# EasyEDA Pro project ESP32C3_Motor_MainControl.eprj, schematic LED_WS2812B
Page Name: P1; Project Name: ESP32C3PowerKey; Schematic Name: LED_WS2812B; Company: 嘉立创EDA; Page Size: A4; Version: V1.0
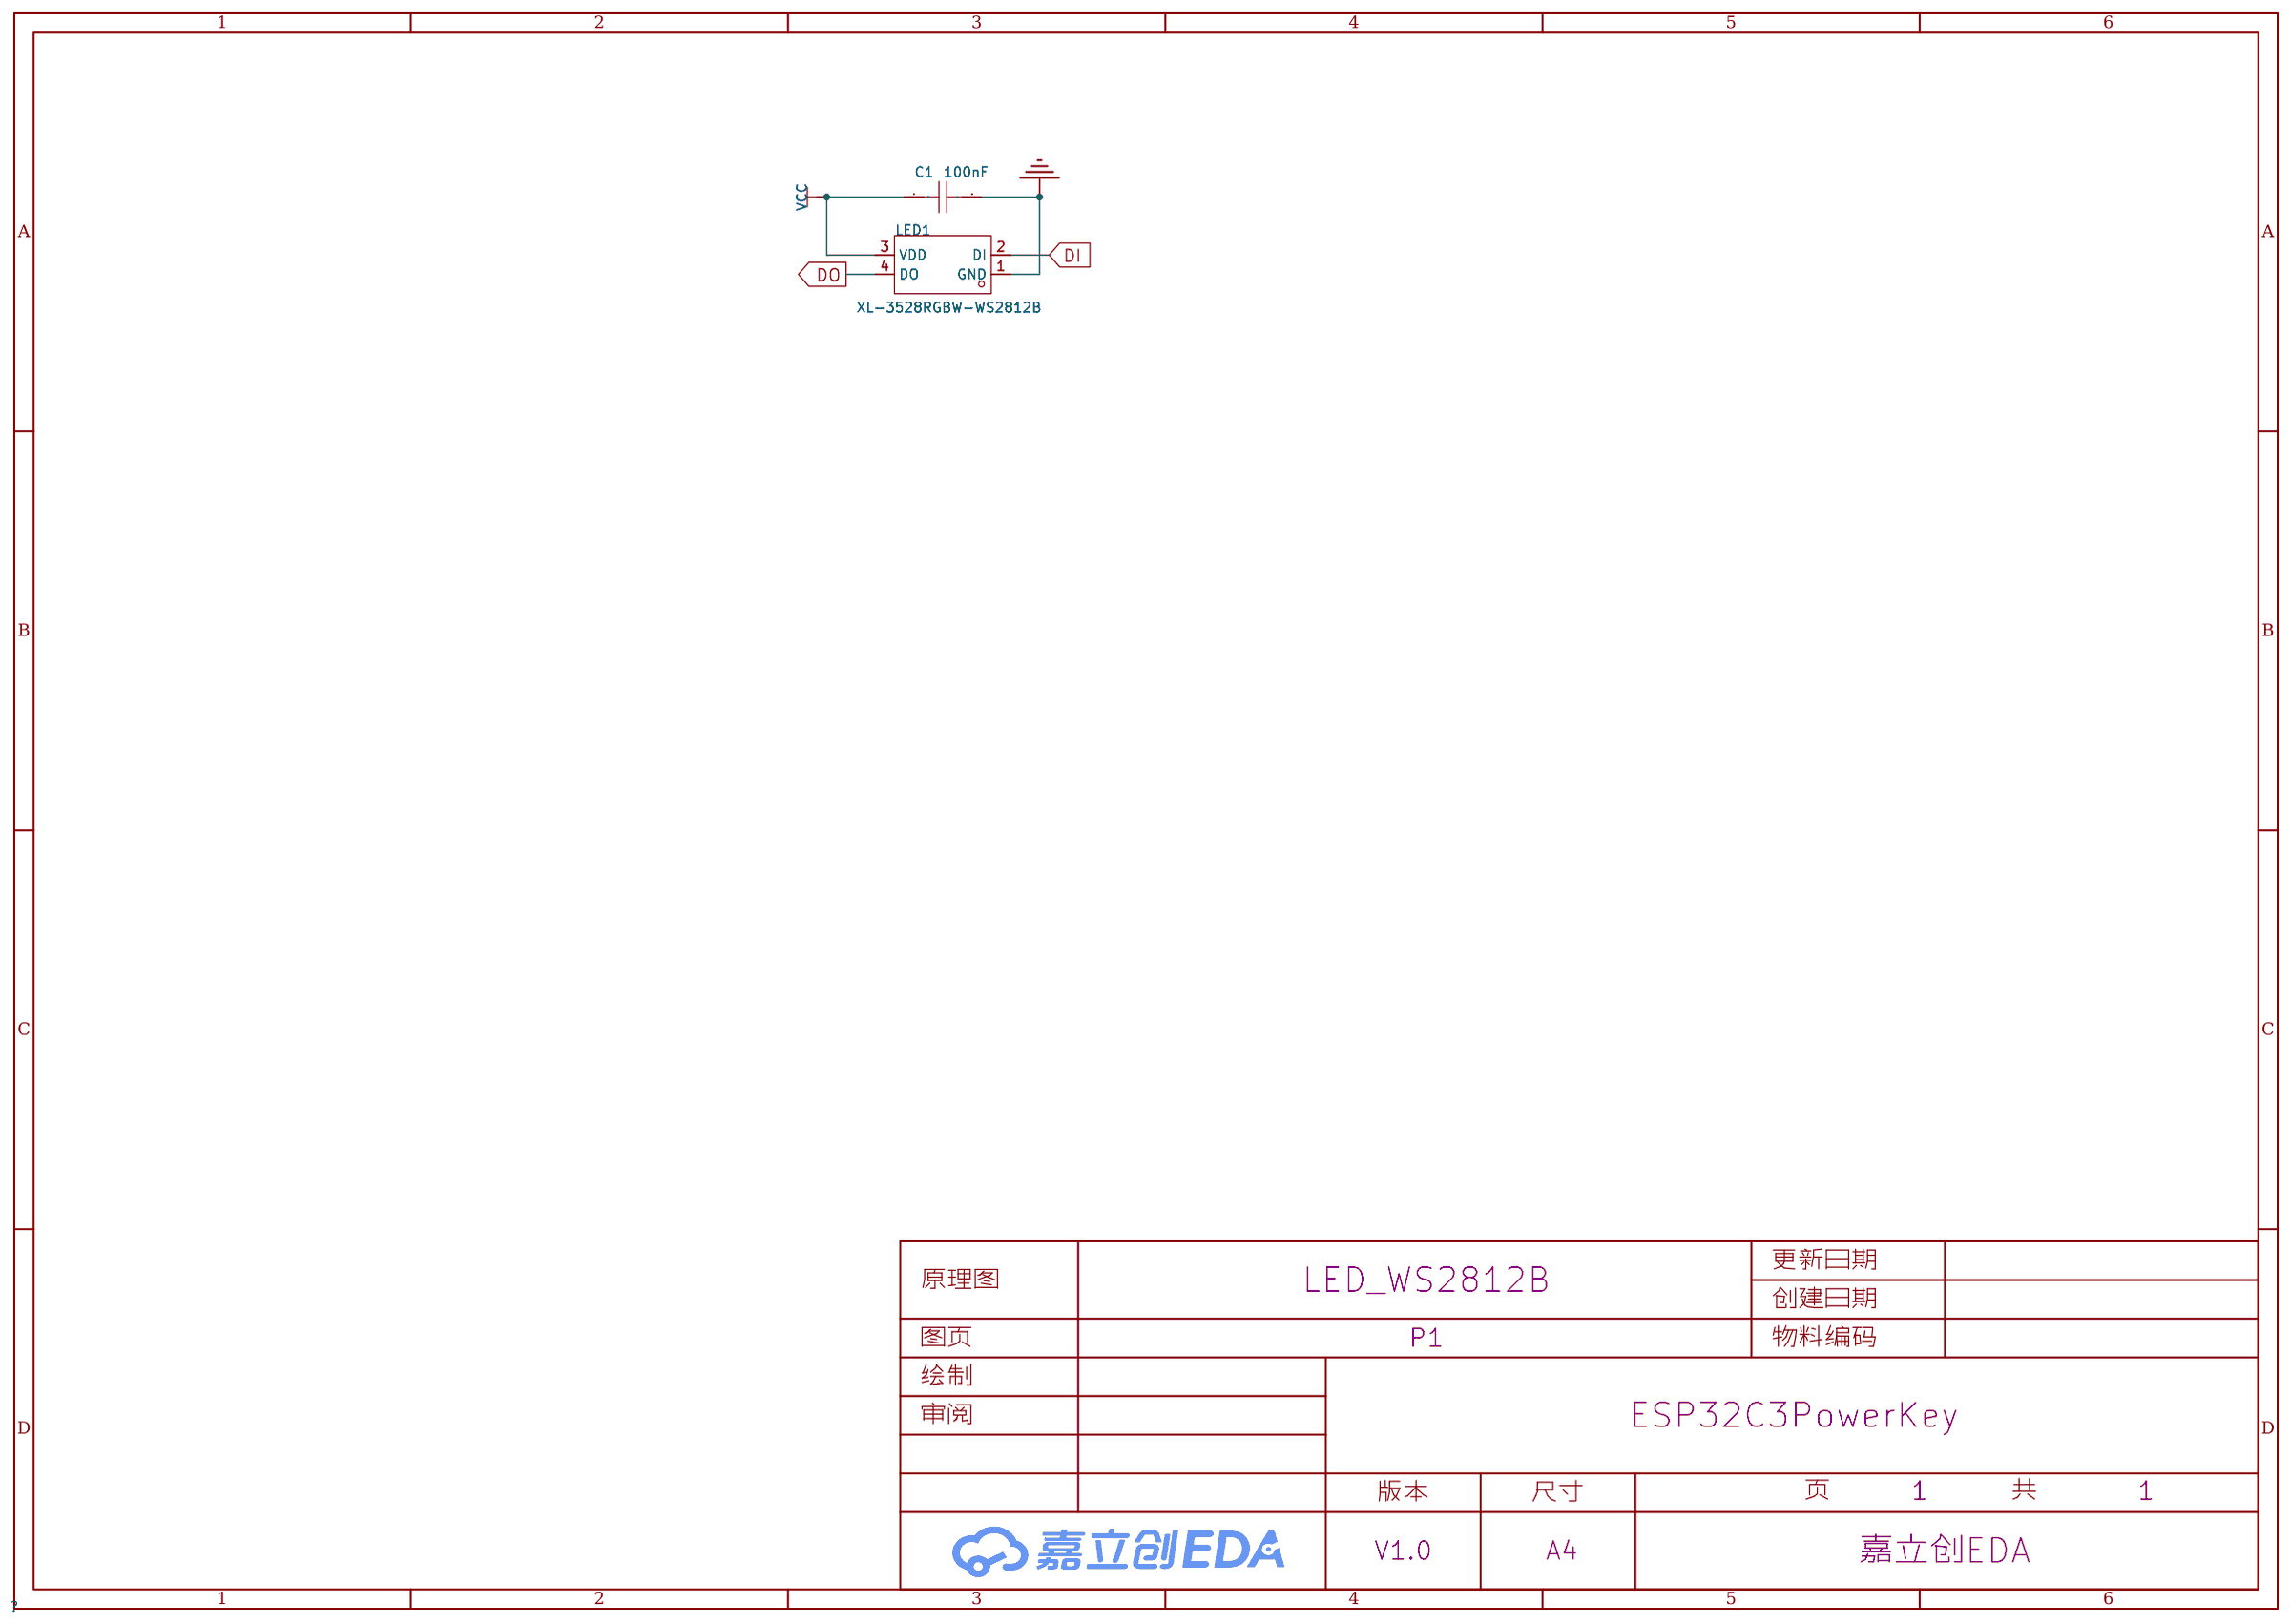
[diagram p2: schematic sheet]

## Parts
C1  100nF  [C0603]
LED1  XL-3528RGBW-WS2812B  [LED-SMD_4P-L3.5-W2.8-BR-1]

## Library data of the parts
C1 = CAP_0603: Supplier Footprint: 0603
LED1 = XL-3528RGBW-WS2812B: 发光颜色:RGB三色;二极管配置:-;功率:50mW；50mW；45mW;主波长:618nm~623nm；520nm~525nm；467nm~472nm;发光角度:120°;安装方式:正贴;工作温度:-25℃~+80℃;; LCSC Part Name: RGB三色 正贴 幻彩; Supplier Part: C2890364; Manufacturer: XINGLIGHT(成兴光); Supplier Footprint: SMD3528-4P; JLCPCB Part Class: 扩展库; Datasheet: https://atta.szlcsc.com/upload/public/pdf/source/20230707/D057C4FFF40CAC379BBCAAC4763A2431.pdf; Supplier: LCSC; Emitted Color: RGB三色; Forward Current: 20mA; Power Dissipation: 50mW；50mW；45mW; Dominant Wavelength: 618nm~623nm；520nm~525nm；467nm~472nm; Peak Wavelength: 525nm；623nm；472nm; Viewing Angle: 120°; Mounting Sytle: 正贴; Operating Temperature: -25℃~+80℃

## Nets
GND: C1.2 LED1.1(GND)
VCC: C1.1 LED1.3(VDD)
DI: LED1.2(DI)
DO: LED1.4(DO)
